# EasyEDA Pro project JILPRO-PCB-NFC卡片_2023-07-22.epro

# Board PCB-NFC卡片
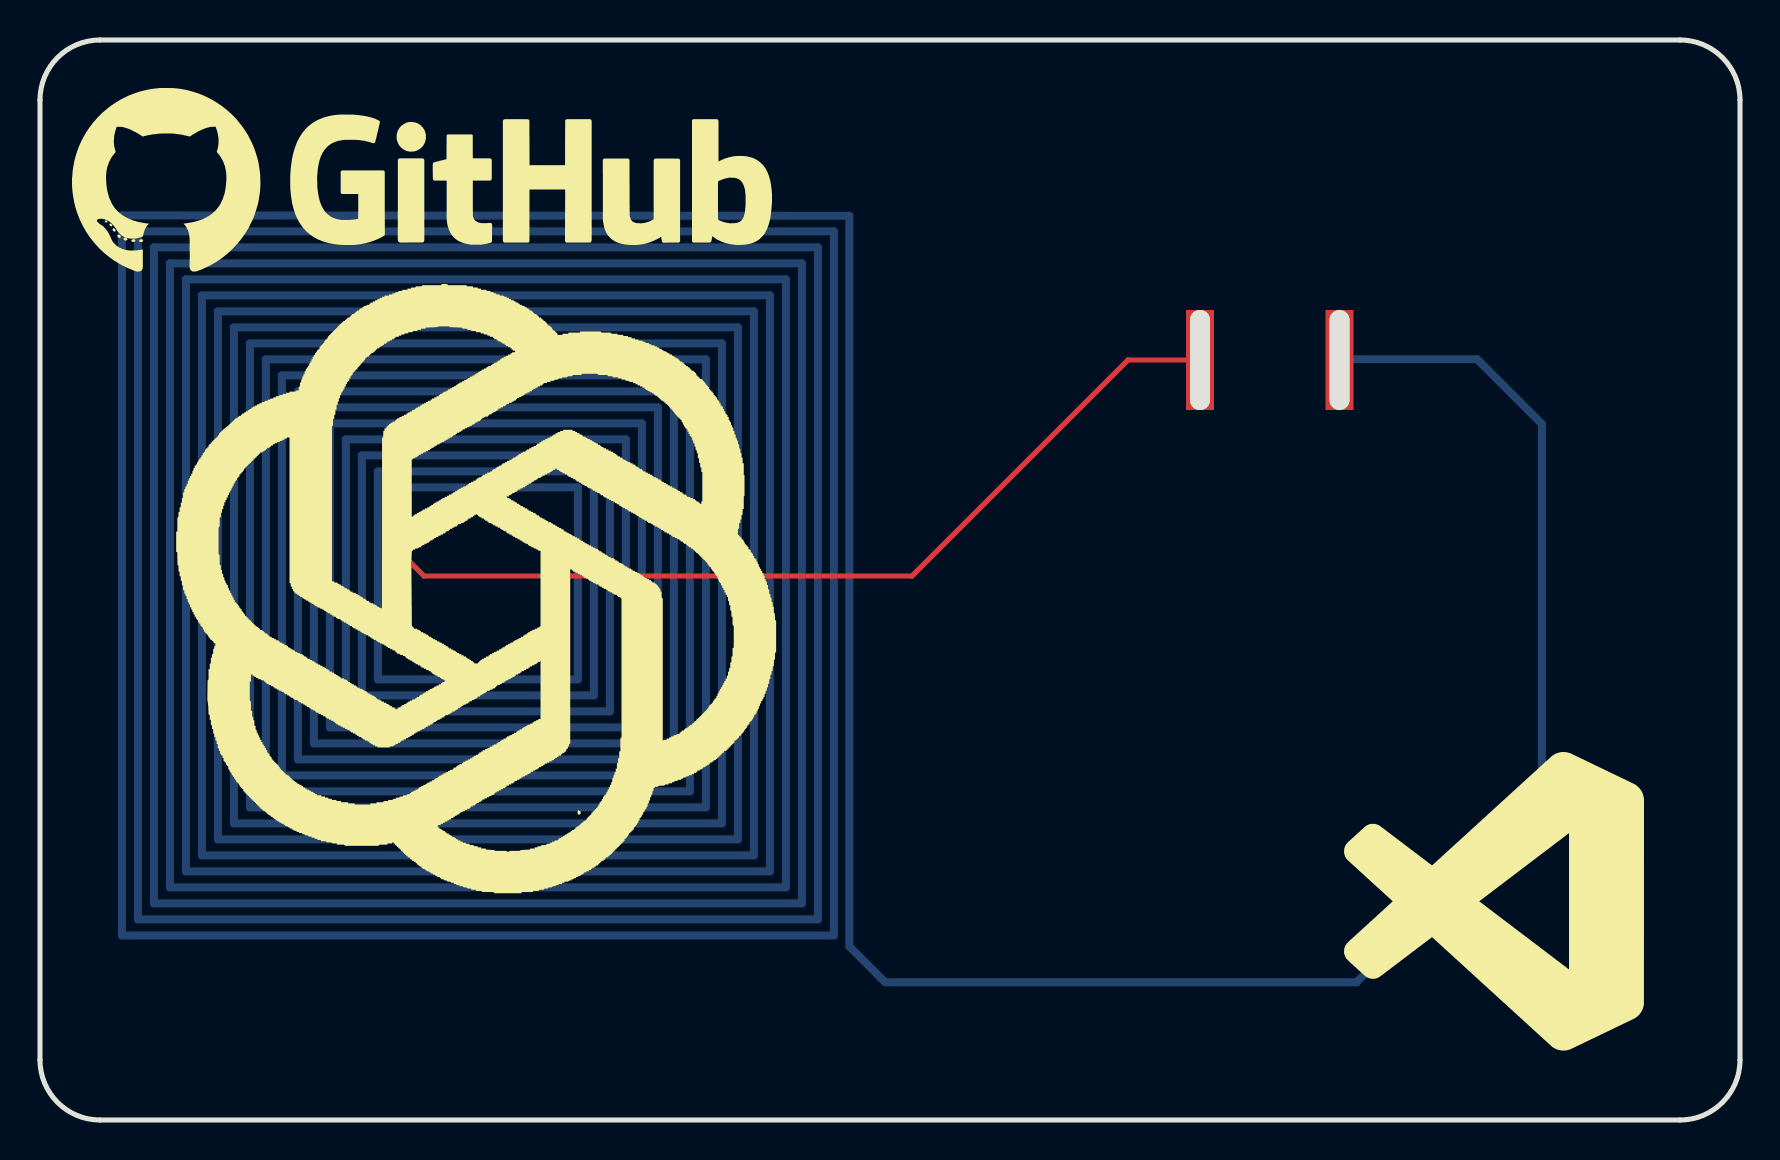
[diagram p0: board, top side]
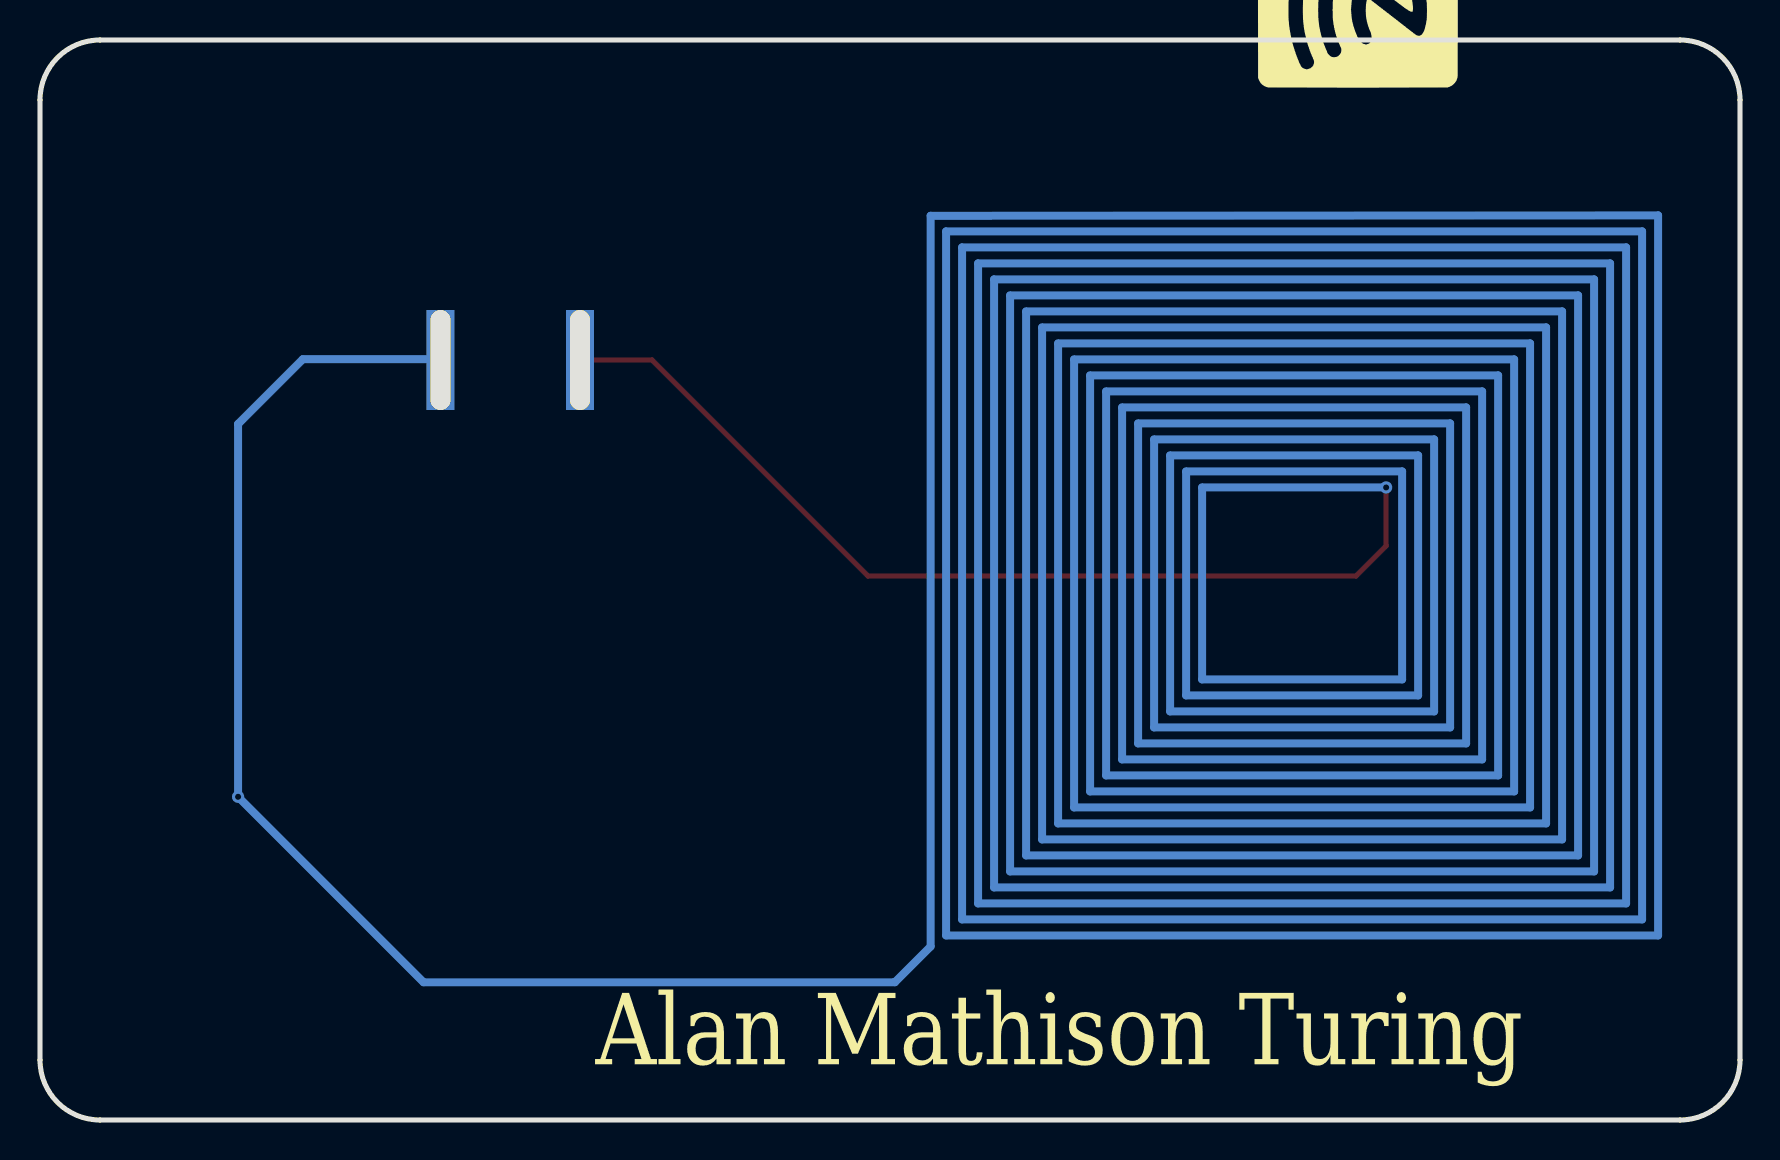
[diagram p1: board, bottom side, seen from below]

Outline 85 x 54 mm; copper layers: Top Layer, Bottom Layer. Coordinates in mm from the lower left corner of the outline.
Outline path: 0,51 0,3 arc(0.88,0.88) 3,0 82,0 arc(84.12,0.88) 85,3 85,51 arc(84.12,53.12) 82,54 3,54 arc(0.88,53.12) 0,51
Stack: Top Layer 0.035mm / Dielectric1 1.51mm FR4 er 4.5 / Bottom Layer 0.035mm

## Design rules (mm)
spacing Default (default): track to track 0.152, other pairs 0 to 0.152
track width Default (default): min 0.254, default 0.254, max 25.4
differential pair differentialPair (default): width min 0.127, default 0.254, max 2.54; gap min 0.152, default 0.152
via Default (default): diameter min 0.61, default 0.61, max 100.025; hole min 0.305, default 0.305, max 59.995

## Placement (name value [footprint] x y rotation side)
NOREF  -  [Pad_e915]  58 38 0 top
NOREF#2  -  [Pad_e916]  64.98 38 0 top

## Footprints (pads in the part's own frame, mm; a bottom-side part is the same pattern mirrored in y, then rotated)
Pad_e915
  rect 1.4x5 hole 1x5: 1(0,0)
Pad_e916
  rect 1.4x5 hole 1x5: 2(0,0)

## Nets
S$39009: NOREF.1 NOREF#2.2

## Via types
v1: diameter 0.61, hole 0.305, Top Layer to Bottom Layer, 2 vias

## Routing (per net, layer and track width the routed paths; a pad name or vN(x,y) marks a point on that pad's centre or on a via; arc(x,y) is an arc through that point)
S$39009: length 1727.4
  Top Layer w0.254: NOREF.1 54.4,38 43.6,27.2 19.2,27.2 17.69,28.71 v1(17.69,31.63)
  Bottom Layer w0.4: NOREF#2.2 65.02,38.04 71.86,38.04 75.1,34.8 v1(75.1,16.16) 65.82,6.89 42.26,6.89 40.47,8.68 40.47,45.21 4.09,45.23 4.09,9.23 39.7,9.23 39.7,44.43 4.89,44.43 4.89,10.03 38.9,10.03 38.9,43.63 5.7,43.63 5.7,10.83 38.1,10.83 38.1,42.83 6.5,42.83 6.5,11.63 37.3,11.63 37.3,42.03 7.3,42.03 7.3,12.43 36.49,12.43 36.49,41.23 8.1,41.23 8.1,13.23 35.7,13.23 35.7,40.43 8.9,40.43 8.9,14.03 34.89,14.03 34.89,39.63 9.7,39.63 9.7,14.83 34.1,14.83 34.1,38.83 10.5,38.83 10.5,15.63 33.3,15.63 33.3,38.03 11.29,38.03 11.29,16.43 32.49,16.43 32.49,37.23 12.09,37.23 12.09,17.23 31.69,17.23 31.69,36.43 12.89,36.43 12.89,18.03 30.89,18.03 30.89,35.63 13.69,35.63 13.69,18.83 30.09,18.83 30.09,34.83 14.49,34.83 14.49,19.63 29.29,19.63 29.29,34.03 15.29,34.03 15.29,20.43 28.49,20.43 28.49,33.23 16.09,33.23 16.09,21.23 27.69,21.23 27.69,32.43 16.89,32.43 16.89,22.03 26.89,22.03 26.89,31.63 v1(17.69,31.63)

## Text on the board
Bottom Silkscreen Layer: Alan Mathison Turing
